# EAGLE design ls_pcb (EAGLE 5.12)
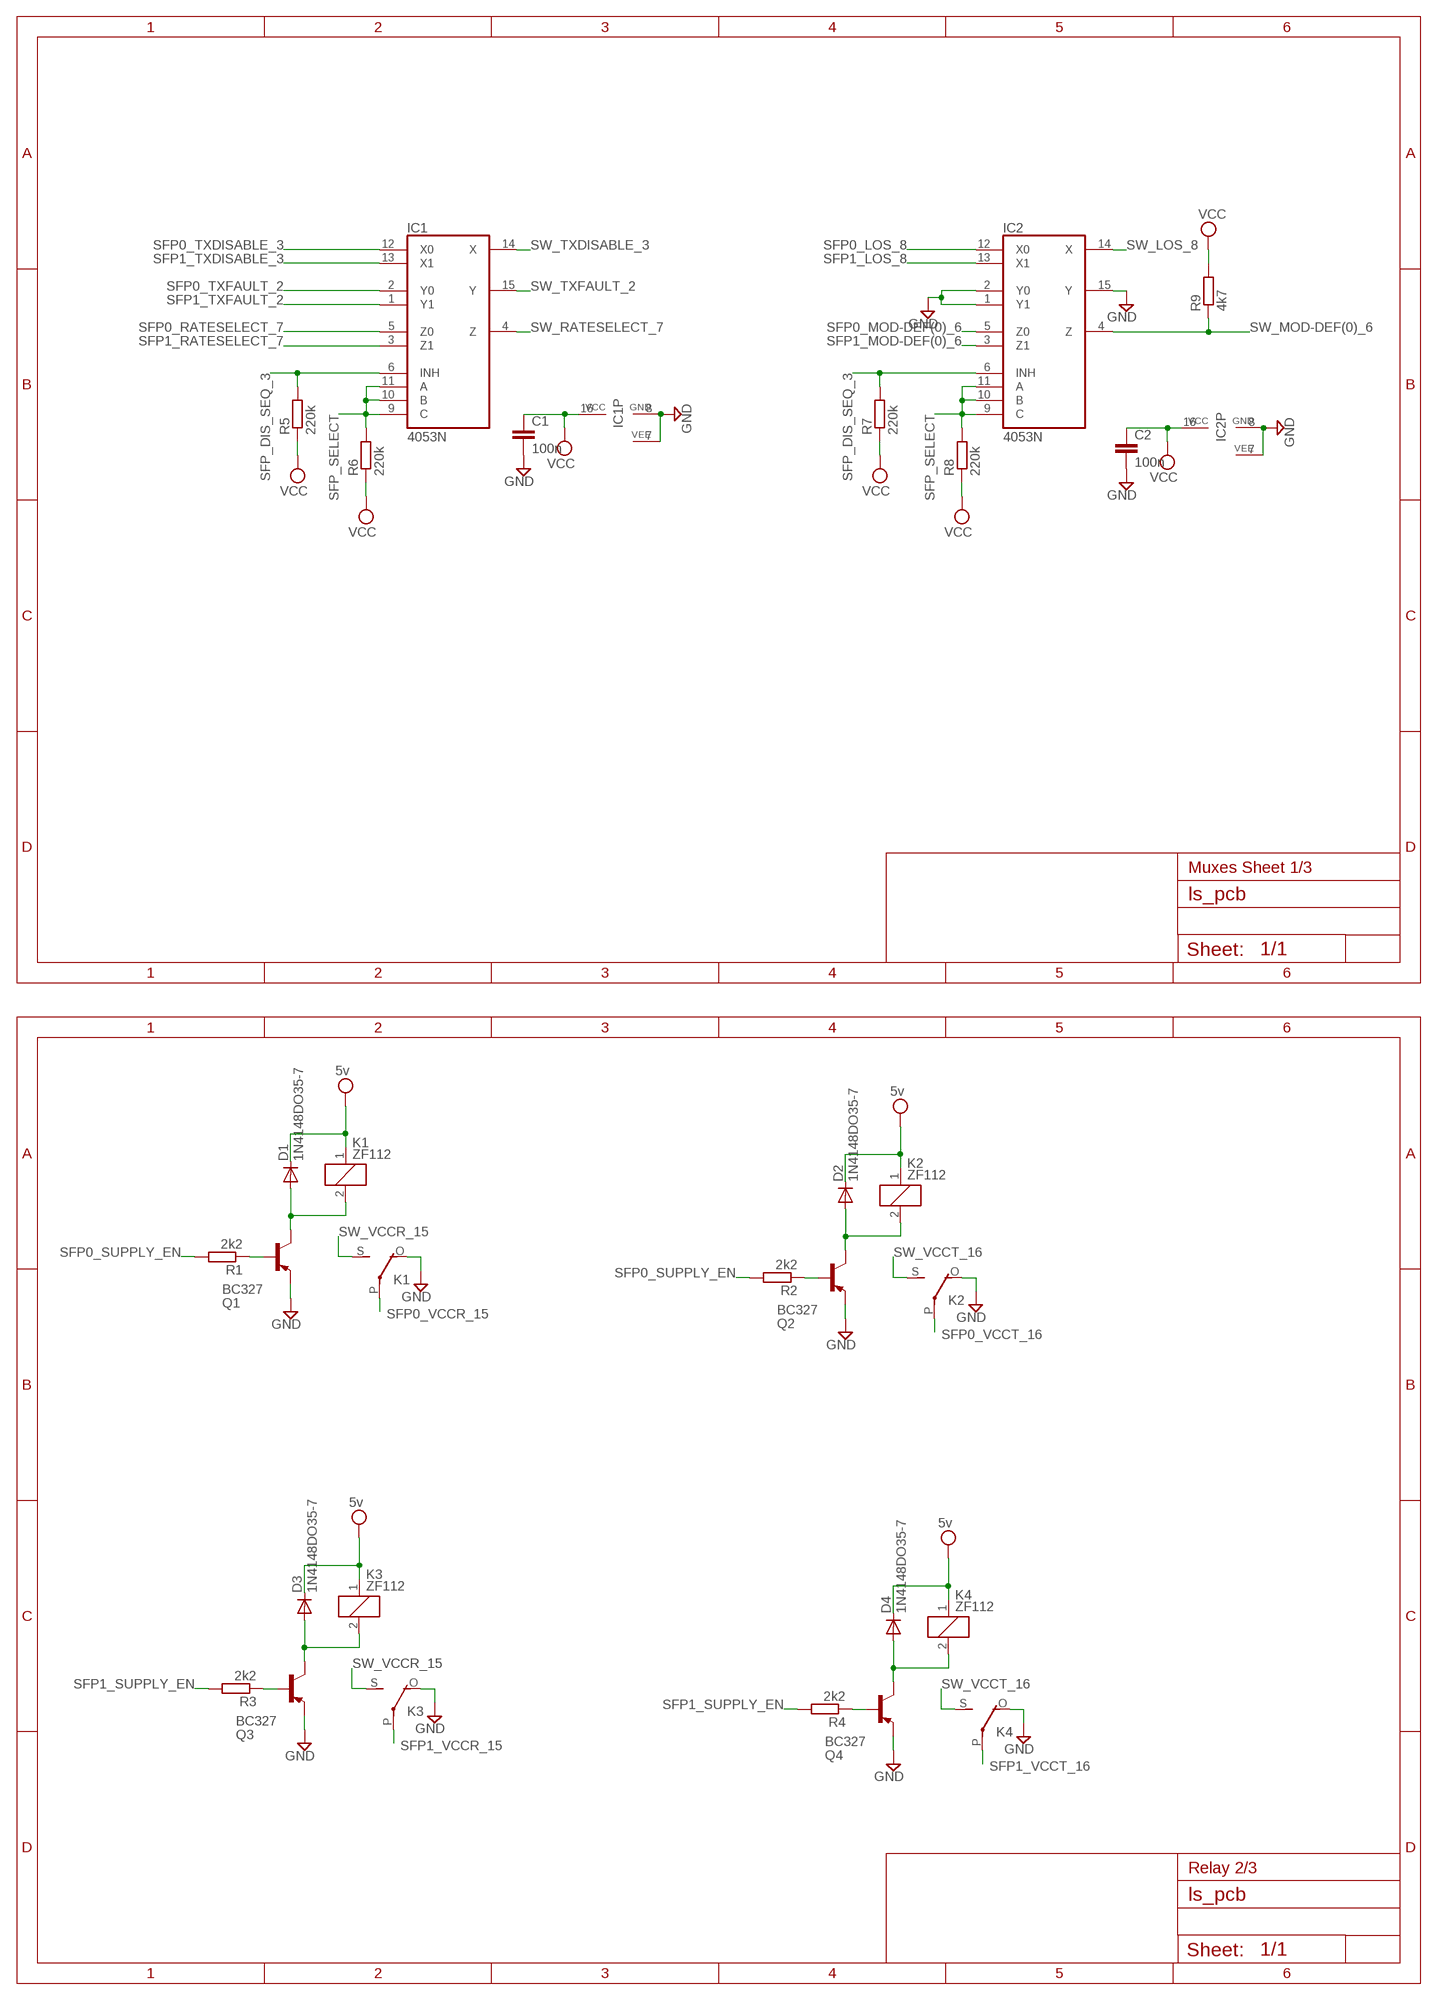
[diagram p0: schematic, sheet 1, part 1 of 2]
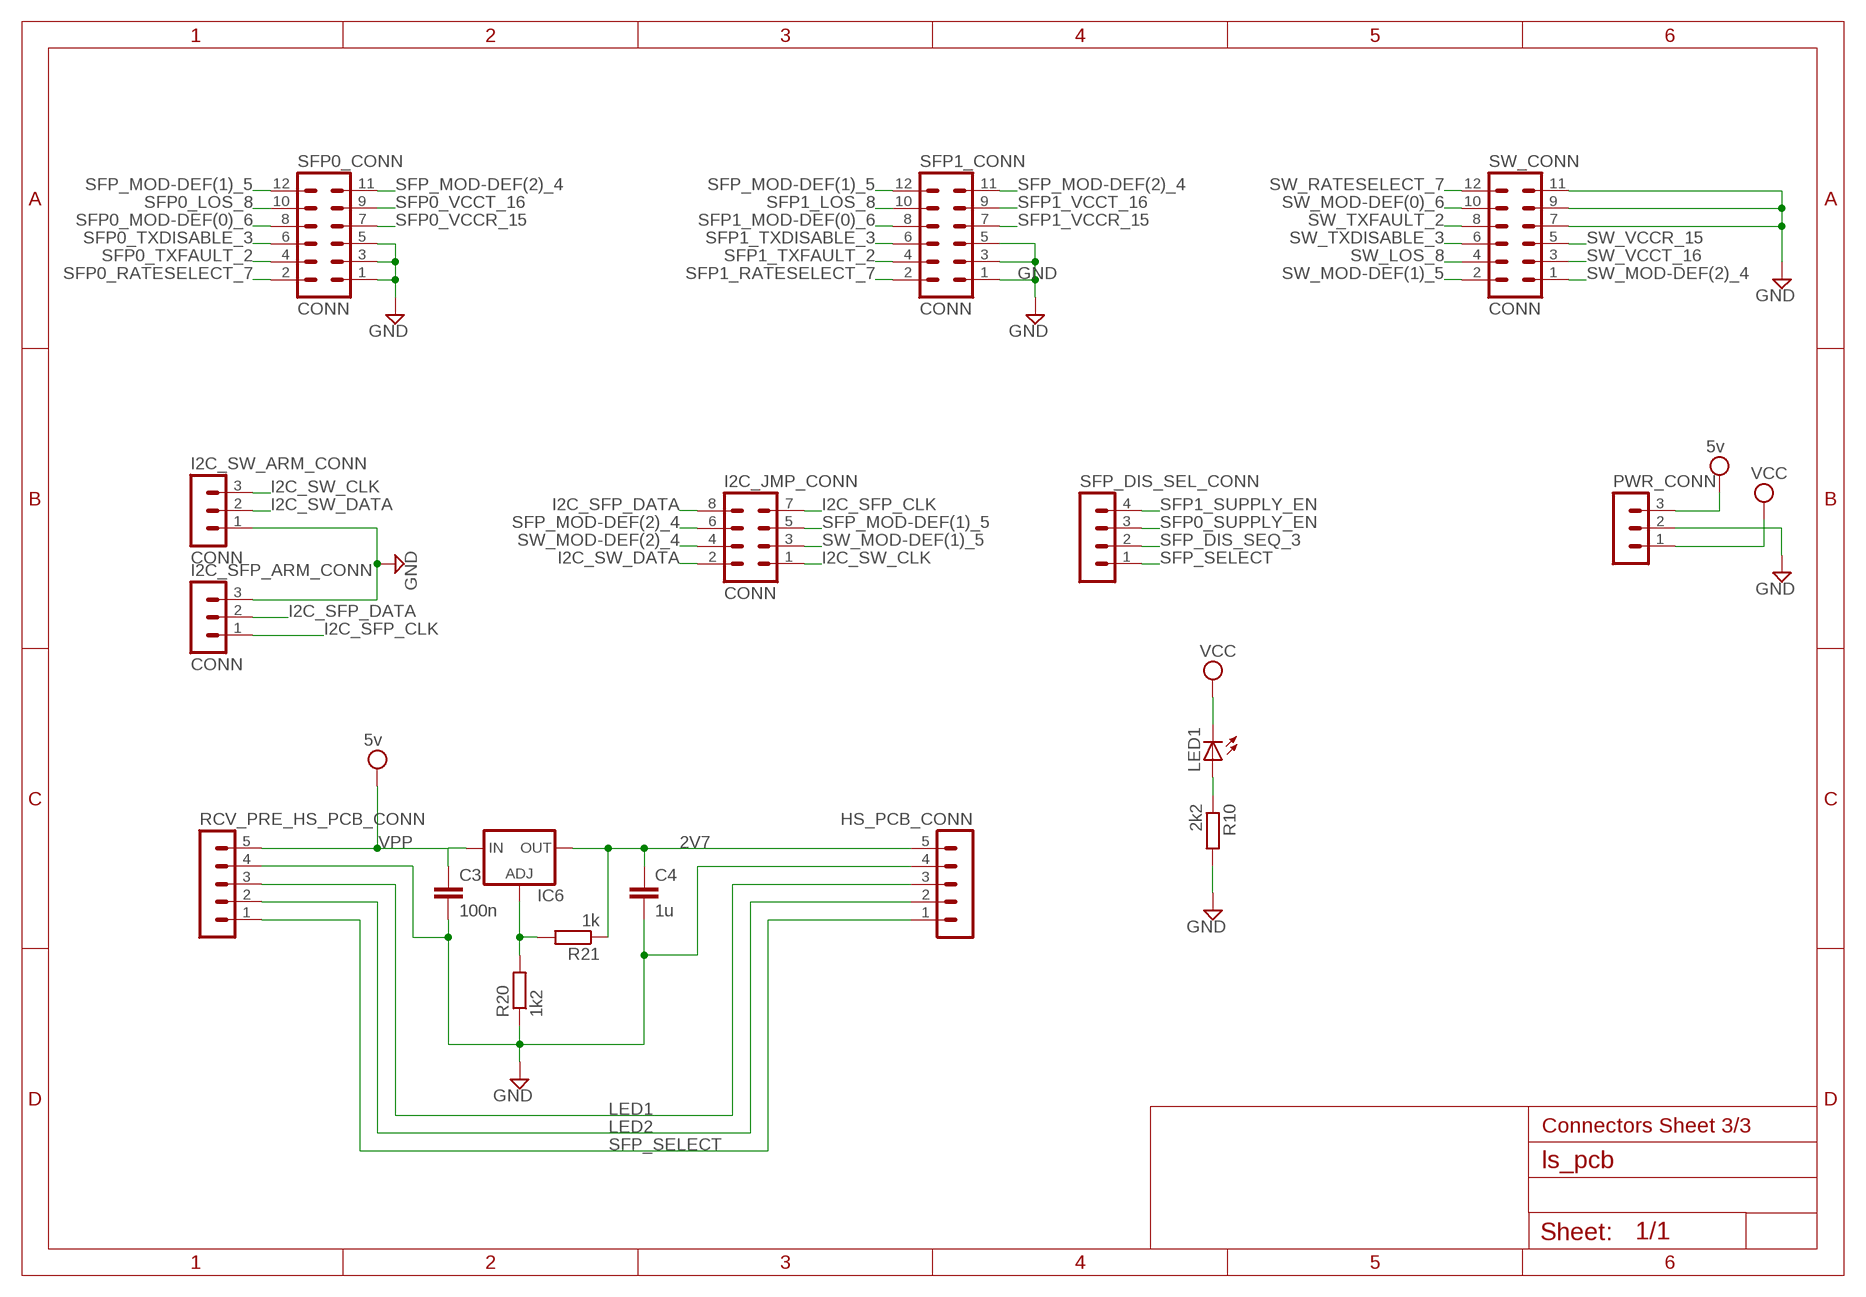
[diagram p1: schematic, sheet 1, part 2 of 2]

## Parts
C1  100n  C-EUC0805  [C0805]
C2  100n  C-EUC0805  [C0805]
C3  100n  C-EUC0805  [C0805]
C4  1u  C-EUC0805  [C0805]
D1  1N4148DO35-7  [DO35-7]
D2  1N4148DO35-7  [DO35-7]
D3  1N4148DO35-7  [DO35-7]
D4  1N4148DO35-7  [DO35-7]
HS_PCB_CONN  MA05-1  [MA05-1]
I2C_JMP_CONN  CONN  MA04-2  [MA04-2]
I2C_SFP_ARM_CONN  CONN  MA03-1  [MA03-1]
I2C_SW_ARM_CONN  CONN  MA03-1  [MA03-1]
IC1  4053N  [DIL16]
IC2  4053N  [DIL16]
IC6  LM138-TL  [TO220L1]
K1  ZF112  [ZF112]
K2  ZF112  [ZF112]
K3  ZF112  [ZF112]
K4  ZF112  [ZF112]
LED1  LEDSML0805  [SML0805]
PWR_CONN  MA03-1  [MA03-1]
Q1  BC327  [TO92-EBC]
Q2  BC327  [TO92-EBC]
Q3  BC327  [TO92-EBC]
Q4  BC327  [TO92-EBC]
R1  2k2  R-EU_M0805  [M0805]
R2  2k2  R-EU_M0805  [M0805]
R3  2k2  R-EU_M0805  [M0805]
R4  2k2  R-EU_M0805  [M0805]
R5  220k  R-EU_M0805  [M0805]
R6  220k  R-EU_M0805  [M0805]
R7  220k  R-EU_M0805  [M0805]
R8  220k  R-EU_M0805  [M0805]
R9  4k7  R-EU_M0805  [M0805]
R10  2k2  R-EU_M0805  [M0805]
R20  1k2  R-EU_M0805  [M0805]
R21  1k  R-EU_M0805  [M0805]
RCV_PRE_HS_PCB_CONN  MA05-1  [MA05-1]
SFP0_CONN  CONN  MA06-2  [MA06-2]
SFP1_CONN  CONN  MA06-2  [MA06-2]
SFP_DIS_SEL_CONN  MA04-1  [MA04-1]
SW_CONN  CONN  MA06-2  [MA06-2]

## Nets
2V7: C4.1 HS_PCB_CONN.5 IC6.2(OUT) R21.1
GND: C1.2 C2.2 C3.2 C4.2 HS_PCB_CONN.4 I2C_SFP_ARM_CONN.3 I2C_SW_ARM_CONN.1 IC1.7(VEE) IC1.8(GND) IC2.1(Y1) IC2.2(Y0) IC2.7(VEE) IC2.8(GND) IC2.15(Y) K1.O(2:O) K2.O(2:O) K3.O(2:O) K4.O(2:O) PWR_CONN.2 Q1.E Q2.E Q3.E Q4.E R10.2 R20.1 RCV_PRE_HS_PCB_CONN.4 SFP0_CONN.1 SFP0_CONN.3 SFP0_CONN.5 SFP1_CONN.1 SFP1_CONN.3 SFP1_CONN.5 SW_CONN.7 SW_CONN.9 SW_CONN.11
I2C_SFP_CLK: I2C_JMP_CONN.7 I2C_SFP_ARM_CONN.1
I2C_SFP_DATA: I2C_JMP_CONN.8 I2C_SFP_ARM_CONN.2
I2C_SW_CLK: I2C_JMP_CONN.1 I2C_SW_ARM_CONN.3
I2C_SW_DATA: I2C_JMP_CONN.2 I2C_SW_ARM_CONN.2
LED1: HS_PCB_CONN.3 RCV_PRE_HS_PCB_CONN.3
LED2: HS_PCB_CONN.2 RCV_PRE_HS_PCB_CONN.2
N$1: Q1.B R1.1
N$2: D1.A K1.2 Q1.C
N$3: IC6.1(ADJ) R20.2 R21.2
N$4: Q2.B R2.1
N$5: D2.A K2.2 Q2.C
N$6: Q3.B R3.1
N$7: D3.A K3.2 Q3.C
N$8: Q4.B R4.1
N$9: D4.A K4.2 Q4.C
N$10: LED1.A R10.1
SFP0_LOS_8: IC2.12(X0) SFP0_CONN.10
SFP0_MOD-DEF(0)_6: IC2.5(Z0) SFP0_CONN.8
SFP0_RATESELECT_7: IC1.5(Z0) SFP0_CONN.2
SFP0_SUPPLY_EN: R1.2 R2.2 SFP_DIS_SEL_CONN.3
SFP0_TXDISABLE_3: IC1.12(X0) SFP0_CONN.6
SFP0_TXFAULT_2: IC1.2(Y0) SFP0_CONN.4
SFP0_VCCR_15: K1.P(2:P) SFP0_CONN.7
SFP0_VCCT_16: K2.P(2:P) SFP0_CONN.9
SFP1_LOS_8: IC2.13(X1) SFP1_CONN.10
SFP1_MOD-DEF(0)_6: IC2.3(Z1) SFP1_CONN.8
SFP1_RATESELECT_7: IC1.3(Z1) SFP1_CONN.2
SFP1_SUPPLY_EN: R3.2 R4.2 SFP_DIS_SEL_CONN.4
SFP1_TXDISABLE_3: IC1.13(X1) SFP1_CONN.6
SFP1_TXFAULT_2: IC1.1(Y1) SFP1_CONN.4
SFP1_VCCR_15: K3.P(2:P) SFP1_CONN.7
SFP1_VCCT_16: K4.P(2:P) SFP1_CONN.9
SFP_DIS_SEQ_3: IC1.6(INH) IC2.6(INH) R5.2 R7.2 SFP_DIS_SEL_CONN.2
SFP_MOD-DEF(1)_5: I2C_JMP_CONN.5 SFP0_CONN.12 SFP1_CONN.12
SFP_MOD-DEF(2)_4: I2C_JMP_CONN.6 SFP0_CONN.11 SFP1_CONN.11
SFP_SELECT: HS_PCB_CONN.1 IC1.9(C) IC1.10(B) IC1.11(A) IC2.9(C) IC2.10(B) IC2.11(A) R6.2 R8.2 RCV_PRE_HS_PCB_CONN.1 SFP_DIS_SEL_CONN.1
SW_LOS_8: IC2.14(X) SW_CONN.4
SW_MOD-DEF(0)_6: IC2.4(Z) R9.1 SW_CONN.10
SW_MOD-DEF(1)_5: I2C_JMP_CONN.3 SW_CONN.2
SW_MOD-DEF(2)_4: I2C_JMP_CONN.4 SW_CONN.1
SW_RATESELECT_7: IC1.4(Z) SW_CONN.12
SW_TXDISABLE_3: IC1.14(X) SW_CONN.6
SW_TXFAULT_2: IC1.15(Y) SW_CONN.8
SW_VCCR_15: K1.S(2:S) K3.S(2:S) SW_CONN.5
SW_VCCT_16: K2.S(2:S) K4.S(2:S) SW_CONN.3
VCC: C1.1 C2.1 IC1.16(VCC) IC2.16(VCC) LED1.C PWR_CONN.1 R5.1 R6.1 R7.1 R8.1 R9.2
VPP: C3.1 D1.C D2.C D3.C D4.C IC6.3(IN) K1.1 K2.1 K3.1 K4.1 PWR_CONN.3 RCV_PRE_HS_PCB_CONN.5 ; supply symbol labelled 5v

## Notes on the sheet
- Muxes Sheet 1/3
- Relay 2/3
- Connectors Sheet 3/3

## Library data of the parts
C1-C4 = rcl:C-EU: CAPACITOR, European symbol
D1-D4 = diode:1N4148: DIODE high speed (Philips)
HS_PCB_CONN RCV_PRE_HS_PCB_CONN = con-lstb:MA05-1: PIN HEADER; OC_FARNELL: unknown; OC_NEWARK: unknown
I2C_JMP_CONN = con-lstb:MA04-2: PIN HEADER; OC_FARNELL: unknown; OC_NEWARK: unknown
I2C_SFP_ARM_CONN I2C_SW_ARM_CONN PWR_CONN = con-lstb:MA03-1: PIN HEADER; OC_FARNELL: unknown; OC_NEWARK: unknown
IC1 IC2 = 40xx:4053: Triple 2-channel ANALOG MULTIPLEXER
IC6 = v-reg:LM138-TL: VOLTAGE REGULATOR
K1-K4 = relay:ZF112: RELAY 1 x switch; OC_FARNELL: unknown; OC_NEWARK: unknown
LED1 = led:LED: LED OSRAM: - CHIPLED LG R971, LG N971, LY N971, LG Q971, LY Q971, LO R971, LY R971 LH N974, LH R974 LS Q976, LO Q976, LY Q976 LO Q996 - Hyper CHIPLED LW Q18S LB Q993, LB Q99A, LB R99A - SideLED LS A670, LO A670, LY A670, LG A670, LP A670 LB A673, LV A673, LT A673, LW A673 LH A674 LY A675 LS A676, LA A676, LO A676, LY A676, LW A676 LS A679, LY A679, LG A679 - Hyper Micro SIDELED® LS Y876, LA Y876, LO Y876, LY Y876 LT Y87S - SmartLED LW L88C, LW L88S LB L89C, LB L89S, LG L890 LS L89K, LO L89K, LY L89K LS L896, LA L896, LO L896, LY L896 - TOPLED LS T670, LO T670, LY T670, LG T670, LP T670 LSG T670, LSP T670, LSY T670, LOP T670, LYG T670 LG T671, LOG T671, LSG T671 LB T673, LV T673, LT T673, LW T673 LH T674 LS T676, LA T676, LO T676, LY T676, LB T676, LH T676, LSB T676, LW T676 LB T67C, LV T67C, LT T67C, LS T67K, LO T67K, LY T67K, LW E67C LS E67B, LA E67B, LO E67B, LY E67B, LB E67C, LV E67C, LT E67C LW T67C LS T679, LY T679, LG T679 LS T770, LO T770, LY T770, LG T770, LP T770 LB T773, LV T773, LT T773, LW T773 LH T774 LS E675, LA E675, LY E675, LS T675 LS T776, LA T776, LO T776, LY T776, LB T776 LHGB T686 LT T68C, LB T68C - Hyper Mini TOPLED® LB M676 - Mini TOPLED Santana® LG M470 LS M47K, LO M47K, LY M47K Source: http://www.osram.convergy.de LUXEON: - LUMILED® LXK2-PW12-R00, LXK2-PW12-S00, LXK2-PW14-U00, LXK2-PW14-V00 LXK2-PM12-R00, LXK2-PM12-S00, LXK2-PM14-U00 LXK2-PE12-Q00, LXK2-PE12-R00, LXK2-PE12-S00, LXK2-PE14-T00, LXK2-PE14-U00 LXK2-PB12-K00, LXK2-PB12-L00, LXK2-PB12-M00, LXK2-PB14-N00, LXK2-PB14-P00, LXK2-PB14-Q00 LXK2-PR12-L00, LXK2-PR12-M00, LXK2-PR14-Q00, LXK2-PR14-R00 LXK2-PD12-Q00, LXK2-PD12-R00, LXK2-PD12-S00 LXK2-PH12-R00, LXK2-PH12-S00 LXK2-PL12-P00, LXK2-PL12-Q00, LXK2-PL12-R00 Source: www.luxeon.com KINGBRIGHT: KA-3528ASYC Source: www.kingbright.com
Q1-Q4 = transistor-pnp:BC327*: PNP Transistror
R1-R10 R20 R21 = rcl:R-EU_: RESISTOR, European symbol
SFP0_CONN SFP1_CONN SW_CONN = con-lstb:MA06-2: PIN HEADER; OC_FARNELL: unknown; OC_NEWARK: unknown
SFP_DIS_SEL_CONN = con-lstb:MA04-1: PIN HEADER; OC_FARNELL: unknown; OC_NEWARK: unknown

## Net classes
0 default: width 0.508 mm, drill 0.508 mm, clearance 0.508 mm

## Board
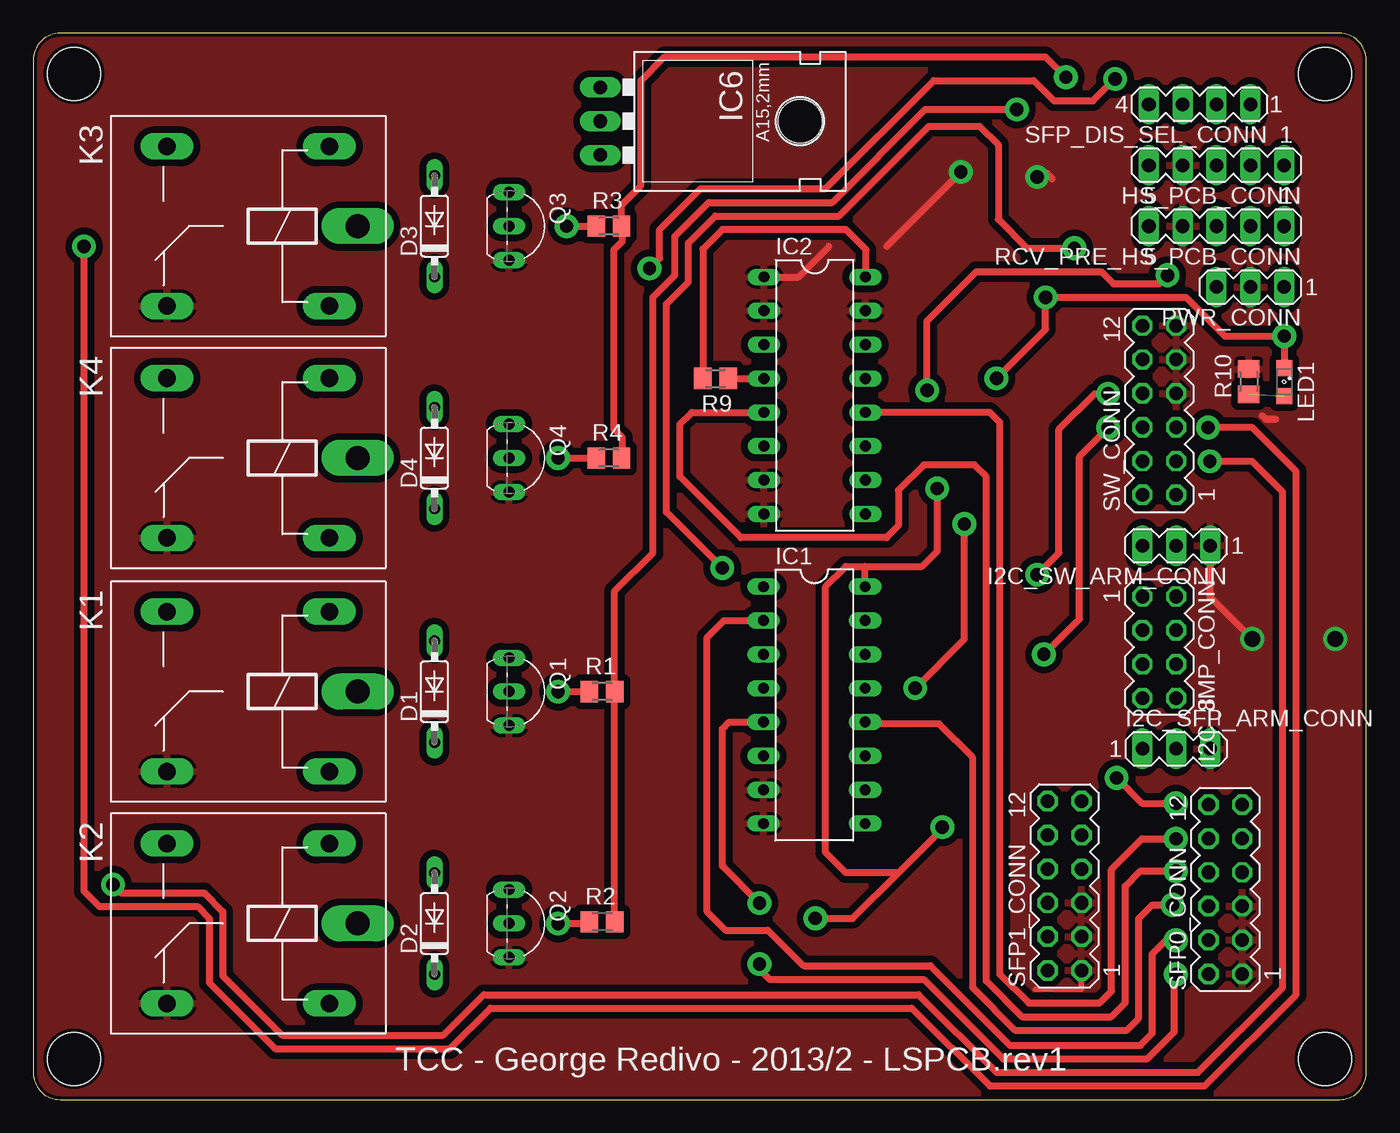
[diagram p2: board, top side]
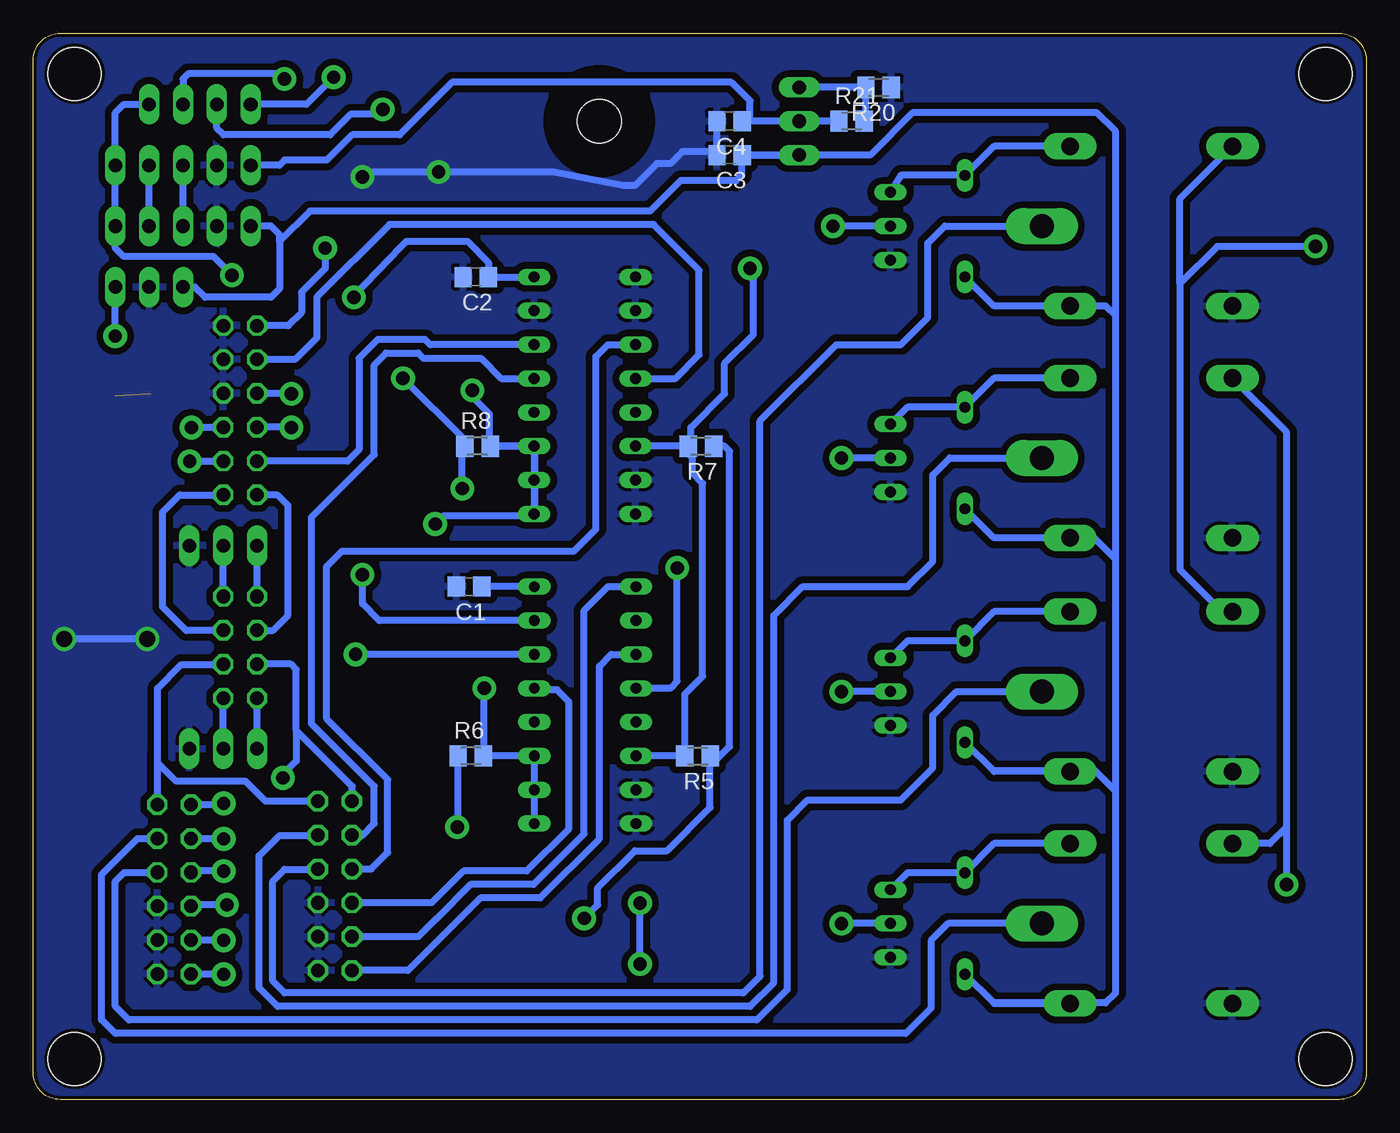
[diagram p3: board, bottom side, seen from below]

Size 100 x 80 mm. Coordinates in mm from the lower left corner, seen from the top.
Outline: 100,78 arc90 98,80 2,80 arc90 0,78 0,2 arc90 2,0 98,0 arc90 100,2 100,78
Copper layers (1*2*15*16): Top 0.035mm / dielectric 0.2mm / layer 2 0.0175mm / dielectric 1.1mm / layer 15 0.0175mm / dielectric 0.2mm / Bottom 0.035mm
Design rules "SeeedStudio_DRU_no_angle_20130527 *": minimum track width 16mil, minimum drill 12mil, track to track 16mil, track to pad 16mil, pad to pad 16mil, via to via 16mil, smd to smd 0mil, copper to edge 10mil, drill to drill 10mil, minimum pad ring 6mil, minimum via ring 6mil, stop-mask expansion 2mil, vias tented up to drill 25mil, thermal gap 10mil
Holes 4 mm at 96.9,3.05 96.9,76.96 3.05,3.05 3.05,76.96

### Footprints (pad centres in the part's own frame; a part is rotated, then mirrored left to right if it is on the bottom)
C0805 = smd 1.3 x 1.5: 1 -0.95,0; 2 0.95,0
DO35-7 = drill 0.813 long: A 3.81,0; C -3.81,0
MA05-1 = drill 1.016 long: 1 -5.08,0; 2 -2.54,0; 3 0,0; 4 2.54,0; 5 5.08,0
MA04-2 = drill 1.016 octagon: 1 -3.81,-1.27; 2 -3.81,1.27; 3 -1.27,-1.27; 4 -1.27,1.27; 5 1.27,-1.27; 6 1.27,1.27; 7 3.81,-1.27; 8 3.81,1.27
MA03-1 = drill 1.016 long: 1 -2.54,0; 2 0,0; 3 2.54,0
DIL16 = drill 0.813 long: 1 -8.89,-3.81; 2 -6.35,-3.81; 3 -3.81,-3.81; 4 -1.27,-3.81; 5 1.27,-3.81; 6 3.81,-3.81; 7 6.35,-3.81; 8 8.89,-3.81; 9 8.89,3.81; 10 6.35,3.81; 11 3.81,3.81; 12 1.27,3.81; 13 -1.27,3.81; 14 -3.81,3.81; 15 -6.35,3.81; 16 -8.89,3.81
TO220L1 = drill 1.016 long: 1 -2.54,-3.81; 2 0,-3.81; 3 2.54,-3.81 | hole 3.302: 0,11.176
ZF112 = drill 1.321 long: 1 -6.096,5.994; 2 -6.096,-5.994; O 6.096,5.994; S 6.096,-5.994 | drill 1.803 long: P -8.204,0
SML0805 = smd 1.2 x 1.2: A 1.05,0; C -1.05,0
TO92-EBC = drill 0.813 long: B 0,-1.27; C -2.54,-1.27; E 2.54,-1.27
M0805 = smd 1.3 x 1.6: 1 -0.95,0; 2 0.95,0
MA06-2 = drill 1.016 octagon: 1 -6.35,-1.27; 2 -6.35,1.27; 3 -3.81,-1.27; 4 -3.81,1.27; 5 -1.27,-1.27; 6 -1.27,1.27; 7 1.27,-1.27; 8 1.27,1.27; 9 3.81,-1.27; 10 3.81,1.27; 11 6.35,-1.27; 12 6.35,1.27
MA04-1 = drill 1.016 long: 1 -3.81,0; 2 -1.27,0; 3 1.27,0; 4 3.81,0

### Placement (x,y rotation side)
C1  67.31,38.48 180 bottom
C2  66.8,61.72 180 bottom
C3  47.75,70.87 180 bottom
C4  47.75,73.41 180 bottom
D1  30.1,30.61 90 top
D2  30.1,13.21 90 top
D3  30.1,65.53 90 top
D4  30.1,48.13 90 top
HS_PCB_CONN  88.77,70.1 180 top
I2C_JMP_CONN  84.48,33.93 270 top
I2C_SFP_ARM_CONN  85.75,26.31 0 top
I2C_SW_ARM_CONN  85.75,41.55 180 top
IC1  58.6,29.59 270 top
IC2  58.62,52.83 270 top
IC6  46.35,73.41 270 top
K1  16.13,30.61 180 top
K2  16.13,13.21 180 top
K3  16.13,65.53 180 top
K4  16.13,48.13 180 top
LED1  93.85,53.85 270 top
PWR_CONN  91.31,60.96 180 top
Q1  36.96,30.61 270 top
Q2  36.96,13.21 270 top
Q3  36.96,65.53 270 top
Q4  36.96,48.13 270 top
R1  42.67,30.61 0 top
R2  42.67,13.34 0 top
R3  43.18,65.53 0 top
R4  43.18,48.13 0 top
R5  50.16,25.78 180 bottom
R6  67.18,25.78 0 bottom
R7  49.91,49.02 180 bottom
R8  66.67,49.02 0 bottom
R9  51.18,54.1 180 top
R10  91.19,53.87 90 top
R20  36.58,75.95 180 bottom
R21  38.61,73.41 0 bottom
RCV_PRE_HS_PCB_CONN  88.77,65.53 180 top
SFP0_CONN  89.43,15.77 90 top
SFP1_CONN  77.37,16.03 90 top
SFP_DIS_SEL_CONN  87.5,74.68 180 top
SW_CONN  84.48,51.71 90 top

### Tracks (layer width: path | path; a pad name or v marks a point on that pad's centre or on a via)
2V7
  Bottom 0.508: R21.1 IC6.2 C4.1 46.23,73.47 46.23,74.93 47.62,76.33 68.58,76.33 72.52,72.39 76.07,72.39 77.98,70.48 81.15,70.48 81.53,70.1 HS_PCB_CONN.5
GND  (via drill 1 pad 1.78, 1.2)
  Top 0.406: SFP1_CONN.1 78.61,9.68 78.61,8.26 75.18,8.26
  Top 0.508: IC2.1 57.4,61.72 59.69,64.01 | v69.6,69.6 64.01,64.01 | v75.31,69.22 76.07,69.47 76.45,69.09 | I2C_SW_ARM_CONN.1 88.29,37.69 v91.44,34.54 | 93.22,51.05 92.46,51.05 92.2,51.31
  Bottom 0.508: C4.2 C3.2 48.96,71.12 51.31,71.12 52.2,70.23 53.21,70.23 54.86,68.58 55.75,68.58 60.96,69.6 v69.6,69.6 74.55,69.6 v75.31,69.22 | v91.44,34.54 v97.66,34.54
  pour Bottom: 0.25,0 0.25,80.01 100.08,80.01 100.08,0
  pour Top: 0.25,0 0.25,80.01 100.08,80.01 100.08,0
I2C_SFP_CLK
  Bottom 0.508: I2C_SFP_ARM_CONN.1 I2C_JMP_CONN.7
I2C_SFP_DATA
  Bottom 0.508: I2C_SFP_ARM_CONN.2 I2C_JMP_CONN.8
I2C_SW_CLK
  Bottom 0.508: I2C_JMP_CONN.1 I2C_SW_ARM_CONN.3
I2C_SW_DATA
  Bottom 0.508: I2C_JMP_CONN.2 I2C_SW_ARM_CONN.2
LED1
  Bottom 0.508: RCV_PRE_HS_PCB_CONN.3 HS_PCB_CONN.3
LED2
  Bottom 0.508: RCV_PRE_HS_PCB_CONN.2 HS_PCB_CONN.2
N$1  (via drill 1 pad 1.78)
  Top 0.508: v39.37,30.61 R1.1
  Bottom 0.508: Q1.B v39.37,30.61
N$2
  Bottom 0.508: K1.2 27.91,36.6 D1.A 34.42,34.42 Q1.C
N$3
  Bottom 0.508: IC6.1 R20.2 37.53,73.54 R21.2
N$4  (via drill 1 pad 1.78)
  Top 0.508: v39.37,13.21 41.59,13.21 R2.1
  Bottom 0.508: Q2.B v39.37,13.21
N$5
  Bottom 0.508: K2.2 27.91,19.2 D2.A 34.42,17.02 Q2.C
N$6  (via drill 1 pad 1.78)
  Top 0.508: v40.01,65.53 R3.1
  Bottom 0.508: Q3.B v40.01,65.53
N$7
  Bottom 0.508: K3.2 27.91,71.53 D3.A 34.92,69.34 Q3.C
N$8  (via drill 1 pad 1.78)
  Top 0.508: v39.37,48.13 R4.1
  Bottom 0.508: Q4.B v39.37,48.13
N$9
  Bottom 0.508: K4.2 27.91,54.13 D4.A 34.42,51.94 Q4.C
N$10  (1 unrouted)
  Top 0.508: LED1.A 93.85,52.77
SFP0_LOS_8  (via drill 1 pad 1.78)
  Top 0.508: v85.72,19.56 83.19,19.56 80.9,17.27 80.9,8.13 80.01,7.24 74.68,7.24 72.52,9.4 72.52,50.8 71.75,51.56 IC2.12
  Bottom 0.508: v85.72,19.56 88.14,19.56 SFP0_CONN.10
SFP0_MOD-DEF(0)_6  (via drill 1 pad 1.78)
  Top 0.508: v85.72,17.14 83.06,17.14 81.92,16 81.92,7.24 80.9,6.22 74.17,6.22 71.5,8.89 71.5,46.74 70.61,47.62 66.8,47.62 64.9,45.72 64.9,43.05 64.01,42.16 53.09,42.16 48.51,46.74 48.51,50.67 49.4,51.56 IC2.5
  Bottom 0.508: v85.72,17.14 88.06,17.14 SFP0_CONN.8
SFP0_RATESELECT_7  (via drill 1 pad 1.78)
  Top 0.508: IC1.5 52.2,28.32 51.69,27.81 51.69,17.53 v54.48,14.73 | v54.48,10.16 54.48,9.78 55.24,9.02 66.8,9.02 72.77,3.05 83.57,3.05 85.6,5.08 85.6,9.27 v85.72,9.4
  Bottom 0.508: v54.48,10.16 v54.48,14.73 | v85.72,9.4 88.14,9.4 SFP0_CONN.2
SFP0_SUPPLY_EN  (via drill 1 pad 1.78)
  Top 0.508: R2.2 R1.2 43.62,38.16 46.48,41.02 46.48,60.2 48.13,61.85 48.13,64.77 50.67,67.31 59.94,67.31 66.93,74.3 v73.79,74.3
  Bottom 0.508: v73.79,74.3 73.91,74.3 74.3,73.91 76.2,73.91 77.72,72.39 85.72,72.39 86.23,72.9 SFP_DIS_SEL_CONN.3
SFP0_TXDISABLE_3  (via drill 1 pad 1.78)
  Top 0.508: IC1.12 62.53,28.19 67.94,28.19 70.48,25.65 70.48,8.38 73.66,5.21 82.04,5.21 82.93,6.1 82.93,13.59 83.95,14.61 v85.47,14.61
  Bottom 0.508: v85.47,14.61 88.06,14.61 SFP0_CONN.6
SFP0_TXFAULT_2  (via drill 1 pad 1.78)
  Top 0.508: IC1.2 51.82,35.94 50.55,34.67 50.55,14.1 51.94,12.7 55.12,12.7 57.78,10.03 67.31,10.03 73.28,4.06 83.06,4.06 83.95,4.95 83.95,10.92 84.96,11.94 v85.72,11.94
  Bottom 0.508: v85.72,11.94 88.14,11.94 SFP0_CONN.4
SFP0_VCCR_15
  Bottom 0.508: K1.P 30.73,30.61 32.51,28.83 32.51,24.89 34.92,22.48 41.91,22.48 43.43,20.95 43.43,8.26 45.72,5.97 92.84,5.97 93.85,6.99 93.85,16.38 93.19,17.04 SFP0_CONN.7
SFP0_VCCT_16
  Bottom 0.508: K2.P 31.37,13.21 32.64,11.94 32.64,6.86 34.54,4.95 93.85,4.95 94.87,5.97 94.87,16.89 92.18,19.58 SFP0_CONN.9
SFP1_LOS_8
  Bottom 0.508: SFP1_CONN.10 75.29,19.84 74.42,20.7 74.42,23.5 79.12,28.19 79.12,43.69 74.42,48.39 74.42,55.12 73.53,56.01 71.12,56.01 70.74,55.63 66.42,55.63 64.9,54.1 IC2.13
SFP1_MOD-DEF(0)_6
  Bottom 0.508: SFP1_CONN.8 74.65,17.3 73.41,18.54 73.41,24 77.98,28.57 77.98,40.01 76.83,41.15 59.44,41.15 57.78,42.8 57.78,55.75 56.9,56.64 IC2.3
SFP1_RATESELECT_7
  Bottom 0.508: IC1.3 56.64,33.4 57.53,32.51 57.53,19.56 61.98,15.11 66.45,15.11 71.88,9.68 SFP1_CONN.2
SFP1_SUPPLY_EN  (via drill 1 pad 1.78)
  Top 0.508: v77.47,76.71 75.95,78.23 47.37,78.23 45.59,76.45 45.59,68.58 44.13,67.12 R3.2 44.2,65.47 44.2,64.39 43.56,63.75 43.56,50.29 44.2,49.66 44.2,48.2 R4.2
  Bottom 0.508: SFP_DIS_SEL_CONN.4 79.5,74.68 v77.47,76.71
SFP1_TXDISABLE_3
  Bottom 0.508: SFP1_CONN.6 70.1,14.76 67.72,17.14 62.99,17.14 59.82,20.32 59.82,29.84 60.71,30.73 62.28,30.73 IC1.13
SFP1_TXFAULT_2
  Bottom 0.508: SFP1_CONN.4 71.12,12.22 69.75,13.59 69.72,13.59 67.18,16.13 62.48,16.13 58.67,19.94 58.67,36.7 56.9,38.48 IC1.1
SFP1_VCCR_15
  Bottom 0.508: K3.P 31.62,65.53 32.89,64.26 32.89,58.67 34.92,56.64 39.75,56.64 45.47,50.93 45.47,9.27 45.59,9.14 46.74,8 81.15,8 82.04,8.89 82.04,16.38 81.15,17.27 79.43,17.27 SFP1_CONN.7
SFP1_VCCT_16
  Bottom 0.508: K4.P 31.24,48.13 32.51,46.86 32.51,40.39 34.42,38.48 42.29,38.48 44.45,36.32 44.45,8.76 46.23,6.99 81.66,6.99 83.06,8.38 83.06,18.29 81.53,19.81 79.43,19.81 SFP1_CONN.9
SFP_DIS_SEQ_3  (via drill 1 pad 1.78)
  Top 0.508: v81.15,76.58 79.5,74.93 76.58,74.93 75.06,76.45 67.56,76.45 59.44,68.33 50.04,68.33 46.99,65.28 46.99,63.12 v46.23,62.36
  Bottom 0.508: IC1.6 R5.2 51.12,30.42 49.78,31.75 49.78,46.23 50.55,46.99 50.55,48.71 R7.2 | R7.2 IC2.6 | R7.2 50.55,49.34 | R7.2 50.86,48.45 50.55,48.13 | R7.2 50.67,49.21 50.67,50.42 48.13,52.96 48.13,55.24 45.97,57.4 45.97,62.1 v46.23,62.36 | v81.15,76.58 81.53,76.96 88.39,76.96 88.77,76.58 SFP_DIS_SEL_CONN.2
SFP_MOD-DEF(1)_5  (via drill 1 pad 1.78)
  Top 0.508: v85.72,22.23 83.19,22.23 v81.28,24.13
  Bottom 0.508: I2C_JMP_CONN.5 80.67,32.66 80.26,32.26 80.26,27.69 | 80.26,27.69 80.26,25.4 81.28,24.38 v81.28,24.13 | v85.72,22.23 86.39,22.25 86.51,22.12 SFP0_CONN.12 | 80.26,27.69 76.07,23.5 76.07,22.4 SFP1_CONN.12
SFP_MOD-DEF(2)_4
  Bottom 0.508: 90.68,26.04 90.68,25.27 89.28,23.88 84.07,23.88 82.58,22.38 SFP1_CONN.11 | 90.68,26.04 90.68,30.86 88.9,32.64 85.78,32.64 I2C_JMP_CONN.6 | SFP0_CONN.11 90.7,26.01 90.68,26.04
SFP_SELECT  (via drill 1 pad 1.78)
  Top 0.508: v69.85,43.18 69.85,34.54 v66.17,30.86 | v67.06,53.21 67.06,58.42 70.74,62.1 80.14,62.1 81.03,61.21 84.45,61.21 v85.09,61.85
  Bottom 0.508: R8.2 IC2.11 IC2.10 IC2.9 | IC1.9 IC1.10 IC1.11 R6.2 66.17,25.85 v66.17,30.86 | R8.2 62.48,49.02 62.36,48.9 62.36,43.81 69.22,43.81 v69.85,43.18 | v67.06,53.21 67.06,52.7 65.79,51.44 65.79,49.08 R8.2 | v85.09,61.85 86.49,63.25 93.22,63.25 93.85,63.88 RCV_PRE_HS_PCB_CONN.1 HS_PCB_CONN.1 93.85,74.04 93.22,74.68 SFP_DIS_SEL_CONN.1
SW_LOS_8
  Bottom 0.508: SW_CONN.4 76.43,47.9 75.56,48.77 75.56,55.63 74.17,57.02 70.61,57.02 70.23,56.64 IC2.14
SW_MOD-DEF(0)_6
  Top 0.508: R9.1 IC2.4
  Bottom 0.508: IC2.4 51.82,54.1 50.04,55.88 50.04,62.23 53.47,65.66 73.28,65.66 78.74,60.2 78.74,57.15 80.37,55.52 SW_CONN.10
SW_MOD-DEF(1)_5
  Bottom 0.508: I2C_JMP_CONN.3 82.02,35.2 80.9,36.32 80.9,44.58 81.66,45.34 83.19,45.34 SW_CONN.2
SW_MOD-DEF(2)_4
  Bottom 0.508: SW_CONN.1 89,45.36 90.3,44.07 90.3,36.96 88.52,35.18 85.78,35.18 I2C_JMP_CONN.4
SW_RATESELECT_7  (via drill 1 pad 1.78)
  Top 0.508: v51.69,39.88 47.5,44.07 47.5,59.69 49.15,61.34 49.15,64.26 51.18,66.29 60.45,66.29 67.18,73.03 70.99,73.03 72.39,71.63 72.39,66.04 74.55,63.88 v78.11,63.88
  Bottom 0.508: IC1.4 52.2,30.86 51.69,31.37 v51.69,39.88 | SW_CONN.12 80.87,58.06 79.88,59.05 79.88,60.58 78.11,62.36 v78.11,63.88
SW_TXDISABLE_3  (via drill 1 pad 1.78)
  Top 0.508: v80.64,50.42 78.49,48.26 78.49,36.07 v75.82,33.4
  Bottom 0.508: SW_CONN.6 80.67,50.44 v80.64,50.42 | IC1.14 v75.82,33.4
SW_TXFAULT_2  (via drill 1 pad 1.78)
  Top 0.508: v80.64,52.96 79.63,52.96 76.96,50.29 76.96,41.02 v75.31,39.37
  Bottom 0.508: SW_CONN.8 80.67,52.98 v80.64,52.96 | v75.31,39.37 75.31,37.21 74.04,35.94 IC1.15
SW_VCCR_15  (via drill 1 pad 1.78)
  Top 0.508: v88.14,50.42 91.44,50.42 94.74,47.12 94.74,7.87 87.88,1.02 71.75,1.02 65.91,6.86 34.29,6.86 31.24,3.81 18.16,3.81 13.21,8.76 13.21,13.59 12.32,14.48 4.95,14.48 3.81,15.62 v3.81,64.01
  Bottom 0.508: K1.S 10.82,36.6 13.97,39.75 13.97,61.21 | 13.97,61.21 13.97,67.59 K3.S | SW_CONN.5 88.11,50.44 v88.14,50.42 | v3.81,64.01 11.18,64.01 13.97,61.21
SW_VCCT_16  (via drill 1 pad 1.78)
  Top 0.508: v88.27,47.88 91.44,47.88 93.73,45.59 93.73,8.38 87.38,2.03 72.26,2.03 66.42,7.87 33.78,7.87 30.73,4.83 18.67,4.83 14.22,9.27 14.22,14.1 12.83,15.49 6.6,15.49 v5.97,16.13
  Bottom 0.508: K2.S 7.21,19.2 5.97,20.45 | 5.97,20.45 5.97,50.06 K4.S | SW_CONN.3 88.24,47.9 v88.27,47.88 | v5.97,16.13 5.97,20.45
VCC  (via drill 1 pad 1.78)
  Top 0.508: v68.2,20.45 68.2,20.32 64.9,17.02 | 64.9,17.02 60.96,17.02 59.44,18.54 59.44,38.48 60.96,40.01 62.36,40.01 | 62.48,38.56 IC1.16 62.36,38.53 62.36,40.01 | v58.67,13.59 61.47,13.59 64.9,17.02 | v72.26,54.1 75.95,57.78 v75.95,60.2 86.49,60.2 89.41,57.28 v93.85,57.28 LED1.C | 62.36,40.01 66.67,40.01 67.82,41.15 v67.82,45.85 | R9.2 50.23,63.82 51.69,65.28 60.96,65.28 62.48,63.75 62.48,61.77 IC2.16
  Bottom 0.508: IC1.16 C1.1 | R6.1 68.13,20.51 v68.2,20.45 | 49.22,25.02 49.22,21.91 52.45,18.67 54.86,18.67 57.66,15.88 57.66,14.61 v58.67,13.59 | 49.22,25.02 49.22,25.27 | 49.22,25.27 R5.1 | v75.95,60.2 75.95,60.33 72.39,64.01 72.01,64.39 67.44,64.39 65.85,62.8 C2.1 IC2.16 | v75.95,60.2 76.07,60.07 | v93.85,57.28 PWR_CONN.1 | 49.22,25.27 48.96,25.53 | v67.82,45.85 67.82,48.83 R8.1 67.62,49.46 v72.26,54.1 | R7.1 48.13,49.02 47.75,48.64 47.75,26.48 49.22,25.02 | v75.95,60.2 76.2,59.94
VPP
  Bottom 0.508: 27.94,24.64 27.91,24.61 K1.1 22.07,24.77 20.45,24.77 | K2.1 27.91,7.21 27.94,7.24 | D4.C 27.91,42.14 K4.1 22.2,42.16 20.45,42.16 18.8,40.51 | D3.C 27.91,59.54 K3.1 19.53,59.54 18.8,58.8 | C3.1 IC6.3 | 27.94,7.24 D2.C | 27.94,7.24 19.56,7.24 18.8,8 18.8,23.11 | 27.94,24.64 D1.C | 27.94,24.64 20.57,24.64 20.45,24.77 | 18.8,23.11 20.45,24.77 | 18.8,23.11 18.8,40.51 | 18.8,40.51 18.8,58.8 | 18.8,58.8 18.8,72.64 20.19,74.04 34.04,74.04 37.21,70.87 C3.1 | C3.1 46.86,70.81 46.86,69.34 47.31,68.89 47.38,68.96 51.44,68.96 53.72,66.67 79.25,66.67 81.53,64.39 | 83.57,65.79 RCV_PRE_HS_PCB_CONN.5 82.17,65.53 81.53,64.9 81.53,64.39 | PWR_CONN.3 87.88,60.96 87.12,60.2 82.17,60.2 81.53,60.83 81.53,64.39

### Text on the board
tNames: TCC - George Redivo - 2013/2 - LSPCB.rev1